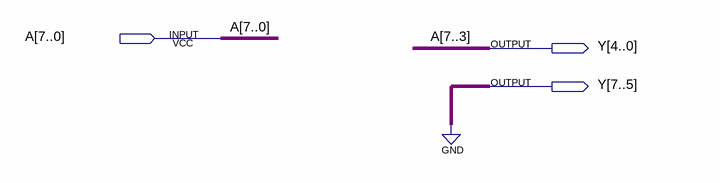
[diagram p0: schematic sheet]
// Quartus schematic 3BitRigthShift.bdf as structural Verilog: 0 symbols, 3 pins
module \3BitRigthShift  (
  input  [7:0] A,
  output [7:0] Y
);


  assign Y = {3'b000, A[7:3]};
endmodule
